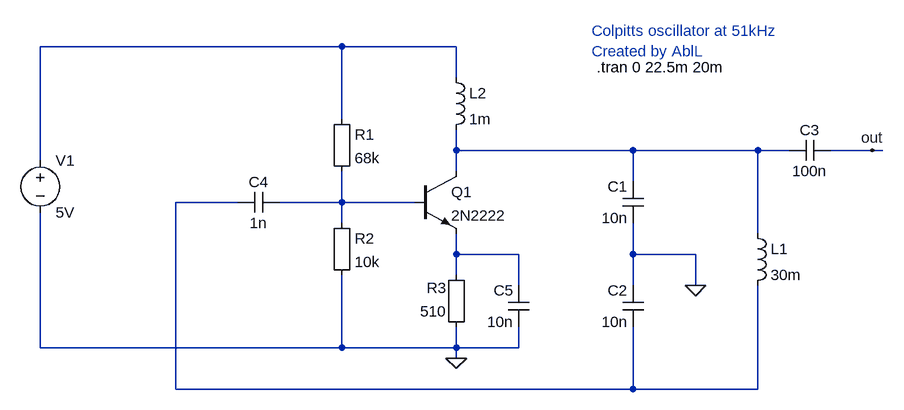
[diagram p0: schematic Colpitts-Oszillator.asc]
Colpitts-Oszillator.asc, the LTspice schematic file:
Version 4
SHEET 1 1664 680
WIRE 800 -800 336 -800
WIRE 976 -800 800 -800
WIRE 976 -752 976 -800
WIRE 800 -688 800 -800
WIRE 976 -640 976 -672
WIRE 1248 -640 976 -640
WIRE 1440 -640 1248 -640
WIRE 1488 -640 1440 -640
WIRE 1616 -640 1552 -640
WIRE 1632 -640 1616 -640
WIRE 336 -624 336 -800
WIRE 976 -608 976 -640
WIRE 1248 -592 1248 -640
WIRE 640 -560 544 -560
WIRE 800 -560 800 -608
WIRE 800 -560 704 -560
WIRE 912 -560 800 -560
WIRE 800 -528 800 -560
WIRE 1440 -512 1440 -640
WIRE 976 -480 976 -512
WIRE 1072 -480 976 -480
WIRE 1248 -480 1248 -528
WIRE 1344 -480 1248 -480
WIRE 976 -448 976 -480
WIRE 1072 -432 1072 -480
WIRE 1248 -432 1248 -480
WIRE 1344 -432 1344 -480
WIRE 336 -336 336 -544
WIRE 800 -336 800 -448
WIRE 800 -336 336 -336
WIRE 976 -336 976 -368
WIRE 976 -336 800 -336
WIRE 1072 -336 1072 -368
WIRE 1072 -336 976 -336
WIRE 976 -320 976 -336
WIRE 544 -272 544 -560
WIRE 1248 -272 1248 -368
WIRE 1248 -272 544 -272
WIRE 1440 -272 1440 -432
WIRE 1440 -272 1248 -272
FLAG 976 -320 0
FLAG 1344 -432 0
FLAG 1616 -640 out
SYMBOL Misc\\EuropeanResistor 784 -704 R0
SYMATTR InstName R1
SYMATTR Value 68k
SYMBOL Misc\\EuropeanResistor 992 -352 R180
WINDOW 0 31 76 Left 2
WINDOW 3 31 40 Left 2
SYMATTR InstName R3
SYMATTR Value 510
SYMBOL cap 704 -576 R90
WINDOW 0 0 32 VBottom 2
WINDOW 3 32 32 VTop 2
SYMATTR InstName C4
SYMATTR Value 1n
SYMBOL npn 912 -608 R0
SYMATTR InstName Q1
SYMATTR Value 2N2222
SYMBOL ind 960 -768 R0
SYMATTR InstName L2
SYMATTR Value 1m
SYMBOL voltage 336 -640 R0
WINDOW 123 0 0 Left 2
WINDOW 39 0 0 Left 2
SYMATTR InstName V1
SYMATTR Value 5V
SYMBOL cap 1088 -368 R180
WINDOW 0 24 56 Left 2
WINDOW 3 24 8 Left 2
SYMATTR InstName C5
SYMATTR Value 10n
SYMBOL Misc\\EuropeanResistor 784 -544 R0
SYMATTR InstName R2
SYMATTR Value 10k
SYMBOL cap 1264 -528 R180
WINDOW 0 24 56 Left 2
WINDOW 3 24 8 Left 2
SYMATTR InstName C1
SYMATTR Value 10n
SYMBOL cap 1264 -368 R180
WINDOW 0 24 56 Left 2
WINDOW 3 24 8 Left 2
SYMATTR InstName C2
SYMATTR Value 10n
SYMBOL ind 1424 -528 R0
SYMATTR InstName L1
SYMATTR Value 30m
SYMBOL cap 1552 -656 R90
WINDOW 0 0 32 VBottom 2
WINDOW 3 32 32 VTop 2
SYMATTR InstName C3
SYMATTR Value 100n
TEXT 1192 -768 Left 2 !.tran 0 22.5m 20m
TEXT 1184 -824 Left 2 ;Colpitts oscillator at 51kHz\nCreated by AblL

The netlist it stands for:
* Colpitts-Oszillator.asc
R1 N001 N004 68k
R3 0 N005 510
C4 N004 N003 1n
Q1 N002 N004 N005 0 2N2222
L2 N001 N002 1m
V1 N001 0 5V
C5 0 N005 10n
R2 N004 0 10k
C1 0 N002 10n
C2 N003 0 10n
L1 N002 N003 30m
C3 out N002 100n
.model NPN NPN
.model PNP PNP
.lib standard.bjt
.tran 0 22.5m 20m
* Colpitts oscillator at 51kHz
* Created by AblL
.backanno
.end